# EAGLE schematic cradle_venus (EAGLE 9.6.2)
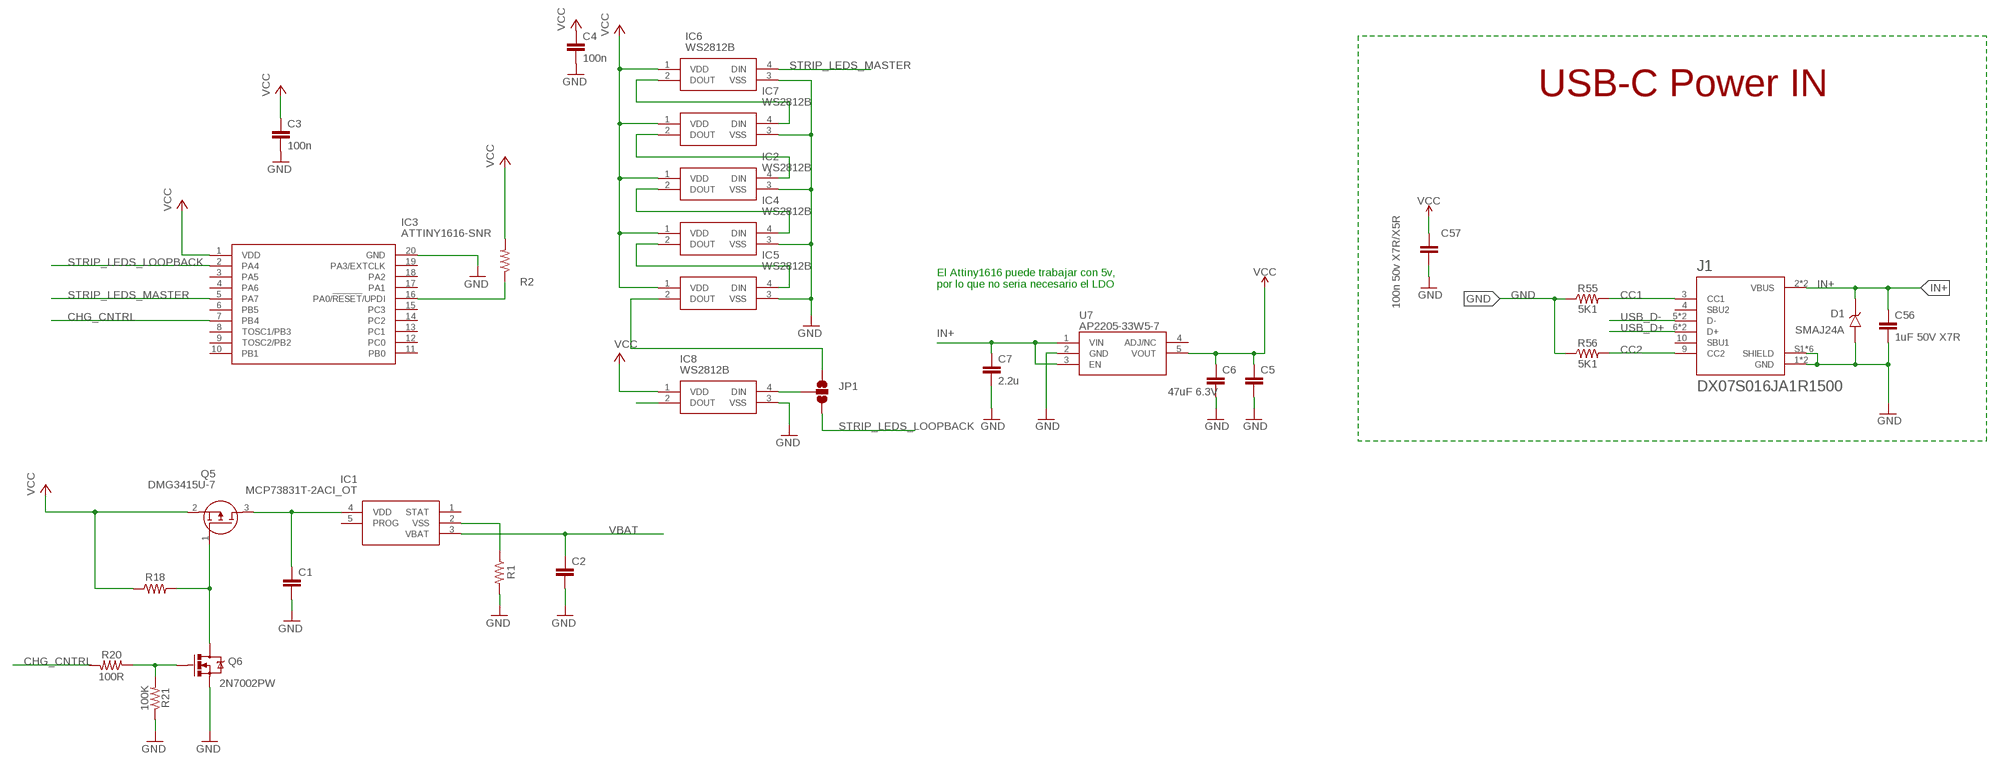
[diagram p0: schematic, sheet 1]

## Parts
C1  C-EUC0805  [C0805]
C2  C-EUC0805  [C0805]
C3  100n  C-EUC0805  [C0805]
C4  100n  C-EUC0805  [C0805]
C5  C-EUC0805  [C0805]
C6  47uF 6.3V  4.7UF-6.3V-10%(0603)0603  [0603-CAP]
C7  2.2u  4.7UF-6.3V-10%(0603)0603  [0603-CAP]
C56  1uF 50V X7R  CAP0805  [0805]
C57  100n 50v X7R/X5R  CAP0805  [0805]
D1  SMAJ24A  3SMAJ5934B  [DIOM4325X244N]
IC1  MCP73831T-2ACI_OT  [SOT95P270X145-5N]
IC2  WS2812B  [WS2812B]
IC3  ATTINY1616-SNR  [SOIC127P1030X265-20N]
IC4  WS2812B  [WS2812B]
IC5  WS2812B  [WS2812B]
IC6  WS2812B  [WS2812B]
IC7  WS2812B  [WS2812B]
IC8  WS2812B  [WS2812B]
J1  DX07S016JA1R1500  [JAE_DX07S016JA1R1500]
JP1  JUMPER-SMT_3_NO_SILK  [SMT-JUMPER_3_NO_SILK]
Q5  DMG3415U-7  SSM3J338R,LF  [SSM3J332RLFT]
Q6  2N7002PW  MOSFET-NCHANNEL2N7002PW  [SOT323]
R1  RESISTOR0805  [0805]
R2  RESISTOR0805  [0805]
R18  RESISTOR0805  [0805]
R20  100R  RESISTOR0805  [0805]
R21  100K  RESISTOR0805  [0805]
R55  5K1  RESISTOR0805  [0805]
R56  5K1  RESISTOR0805  [0805]
U7  AP2205-33W5-7  AP2205-W5-7  [SOT95P282X145-5N]

## Nets
CC1: J1.3(CC1) R55.2
CC2: J1.9(CC2) R56.2
CHG_CNTRL: IC3.7(PB4) R20.2
GND: C1.2 C2.2 C3.2 C4.2 C5.2 C6.2 C7.2 C56.2 C57.2 D1.A IC2.3(VSS) IC3.20(GND) IC4.3(VSS) IC5.3(VSS) IC6.3(VSS) IC7.3(VSS) IC8.3(VSS) J1.1(GND) J1.12(GND) J1.S1(SHIELD) J1.S2(SHIELD) J1.S3(SHIELD) J1.S4(SHIELD) J1.S5(SHIELD) J1.S6(SHIELD) Q6.2(S) R1.2 R21.1 R55.1 R56.1 U7.2(GND)
IN+: C7.1 C56.1 D1.C(K) J1.2(VBUS) J1.11(VBUS) U7.1(VIN) U7.3(EN)
N$1: C1.1 IC1.4(VDD) Q5.3(D)
N$2: IC6.2(DOUT) IC7.4(DIN)
N$3: IC1.2(VSS) R1.1
N$4: IC3.16(PA0/!RESET!/UPDI) R2.1
N$5: IC2.2(DOUT) IC4.4(DIN)
N$6: IC4.2(DOUT) IC5.4(DIN)
N$7: Q6.1(G) R20.1 R21.2
N$8: IC2.4(DIN) IC7.2(DOUT)
N$9: IC8.4(DIN) JP1.2
N$10: IC5.2(DOUT) JP1.1
N$11: IC8.2(DOUT)
N$12: Q5.1(G) Q6.3(D) R18.2
STRIP_LEDS_LOOPBACK: IC3.2(PA4) JP1.3
STRIP_LEDS_MASTER: IC3.5(PA7) IC6.4(DIN)
USB_D+: J1.6(D+) J1.7(D+)
USB_D-: J1.5(D-) J1.8(D-)
VBAT: C2.1 IC1.3(VBAT)
VCC [highpower]: C3.1 C4.1 C5.1 C6.1 C57.1 IC2.1(VDD) IC3.1(VDD) IC4.1(VDD) IC5.1(VDD) IC6.1(VDD) IC7.1(VDD) IC8.1(VDD) Q5.2(S) R2.2 R18.1 U7.5(VOUT)
Unconnected: IC1.1(STAT) IC1.5(PROG) IC3.3(PA5) IC3.4(PA6) IC3.6(PB5) IC3.8(TOSC1/PB3) IC3.9(TOSC2/PB2) IC3.10(PB1) IC3.11(PB0) IC3.12(PC0) IC3.13(PC1) IC3.14(PC2) IC3.15(PC3) IC3.17(PA1) IC3.18(PA2) IC3.19(PA3/EXTCLK) J1.4(SBU2) J1.10(SBU1) U7.4(ADJ/NC)

## Notes on the sheet
- USB-C Power IN
- El Attiny1616 puede trabajar con 5v, 
  por lo que no seria necesario el LDO

## Library data of the parts
C1-C5 = resistor:C-EU: CAPACITOR, European symbol
C6 C7 = SparkFun-Capacitors:4.7UF-6.3V-10%(0603): CAP-08280; PROD_ID: CAP-08280; VALUE: 4.7uF
C56 C57 = SparkFun-Passives:CAP: Capacitor Standard 0603 ceramic capacitor, and 0.1" leaded capacitor.
D1 = 3SMAJ5934B:3SMAJ5934B: Check availability <https://pricing.snapeda.com/parts/3SMAJ5934B/Micro%20Commercial%20Components/view-part?ref=eda>; AVAILABILITY: Not in stock; DESCRIPTION: Zener Diode Single 24V 5% 19Ohm 3000mW 2-Pin SMA T/R; MF: Micro Commercial Components; MP: 3SMAJ5934B; PACKAGE: None; PRICE: None
IC1 = SamacSys_Parts:MCP73831T-2ACI_OT: Li-Ion Charge Controller 4.2V SOT23-5 Source: Datasheet <http://ww1.microchip.com/downloads/en/DeviceDoc/20001984g.pdf>; ARROW_PART_NUMBER: MCP73831T-2ACI/OT; ARROW_PRICE-STOCK: https://www.arrow.com/en/products/mcp73831t-2aciot/microchip-technology?utm_currency=USD&region=europe; DESCRIPTION: Li-Ion Charge Controller 4.2V SOT23-5; HEIGHT: 1.45mm; MANUFACTURER_NAME: Microchip; MANUFACTURER_PART_NUMBER: MCP73831T-2ACI/OT; MOUSER_PART_NUMBER: 579-MCP73831T-2ACIOT; MOUSER_PRICE-STOCK: https://www.mouser.co.uk/ProductDetail/Microchip-Technology/MCP73831T-2ACI-OT?qs=yUQqVecv4qvbBQBGbHx0Mw%3D%3D
IC2 IC4-IC8 = SamacSys_Parts:WS2812B: NeoPixel 5050 RGB LED with Integrated Driver Chip - 10 Pack Source: Datasheet <https://cdn-shop.adafruit.com/datasheets/WS2812B.pdf>; DESCRIPTION: NeoPixel 5050 RGB LED with Integrated Driver Chip - 10 Pack; HEIGHT: 1.62mm; MANUFACTURER_NAME: Adafruit; MANUFACTURER_PART_NUMBER: WS2812B
IC3 = SamacSys_Parts:ATTINY1616-SNR: 8-bit Microcontrollers - MCU 20MHZ SOIC 85C GRN Source: Datasheet <https://datasheet.datasheetarchive.com/originals/distributors/DKDS41/DSANUWW0026757.pdf>; ARROW_PART_NUMBER: ATTINY1616-SNR; ARROW_PRICE-STOCK: https://www.arrow.com/en/products/attiny1616-snr/microchip-technology?utm_currency=USD&region=nac; DESCRIPTION: 8-bit Microcontrollers - MCU 20MHZ SOIC 85C GRN; HEIGHT: 2.65mm; MANUFACTURER_NAME: Microchip; MANUFACTURER_PART_NUMBER: ATTINY1616-SNR; MOUSER_PART_NUMBER: 556-ATTINY1616SNR; MOUSER_PRICE-STOCK: https://www.mouser.co.uk/ProductDetail/Microchip-Technology/ATTINY1616-SNR?qs=HXFqYaX1Q2w711d4DTfCdw%3D%3D
J1 = DX07S016JA1R1500:DX07S016JA1R1500: USB-C (USB TYPE-C) USB 2.0 Receptacle Connector 24 (16+8 Dummy) Position Surface Mount, Right Angle; Through Hole; DESCRIPTION: USB-C (USB TYPE-C) USB 2.0 Receptacle Connector 24 (16+8 Dummy) Position Surface Mount, Right Angle; Through Hole; DIGI-KEY_PART_NUMBER: 670-DX07S016JA1R1500CT-ND; MF: JAE Electronics; MP: DX07S016JA1R1500; PACKAGE: None; PURCHASE-URL: https://pricing.snapeda.com/search/part/DX07S016JA1R1500/?ref=eda
JP1 = SparkFun-Jumpers:JUMPER-SMT_3_NO: Normally open jumper This jumper has three pads in close proximity to each other. Apply solder to close the connection(s).
Q5 = SSM3J338R_LF:SSM3J338R,LF: MOSFET Small-signal MOSFET Vdss= -12V, ID= -6A Source: Datasheet <http://toshiba.semicon-storage.com/info/docget.jsp?did=30384&prodName=SSM3J338R>; ARROW_PART_NUMBER: SSM3J338R,LF; ARROW_PRICE-STOCK: https://www.arrow.com/en/products/ssm3j338rlf/toshiba?region=nac; DESCRIPTION: MOSFET Small-signal MOSFET Vdss= -12V, ID= -6A; HEIGHT: mm; MANUFACTURER_NAME: Toshiba; MANUFACTURER_PART_NUMBER: SSM3J338R,LF; MOUSER_PART_NUMBER: 757-SSM3J338RLF; MOUSER_PRICE-STOCK: https://www.mouser.co.uk/ProductDetail/Toshiba/SSM3J338RLF?qs=lhkzy8lC%252BSvURFM9ZjmJSw%3D%3D
Q6 = SparkFun-DiscreteSemi:MOSFET-NCHANNEL: Common NMOSFET Parts MFG P/N Store ID Prod ID FDD8780 TRANS-09984 SI7820DN TRANS-11055 FDS6630A IC-08089 2N7002PW TRANS-11151 FQP30N06L COM-10213 TRANS-10060 BSS123LT1G TRANS-08345 BSS138 TRANS-00830 BS170 2N7000; PROD_ID: TRANS-11151
R1 R2 R18 R20 R21 R55 R56 = SparkFun-Resistors:RESISTOR: Generic Resistor Package
U7 = AP2205-W5-7:AP2205-W5-7: LDO Voltage Regulators LDO CMOS LowCurr Source: Datasheet <https://www.diodes.com/assets/Datasheets/AP2206.pdf>; DESCRIPTION: LDO Voltage Regulators LDO CMOS LowCurr; HEIGHT: 1.45mm; MANUFACTURER_NAME: Diodes Inc.; MANUFACTURER_PART_NUMBER: AP2205-W5-7; MOUSER_PART_NUMBER: 621-AP2205-W5-7; MOUSER_PRICE-STOCK: https://www.mouser.com/Search/Refine.aspx?Keyword=621-AP2205-W5-7

## Net classes
1 highpower: width 0.254 mm, drill 0.483 mm